# Altium schematic sheet REF-Controller.SchDoc
size 384 x 574 mm; SheetNumber: 1
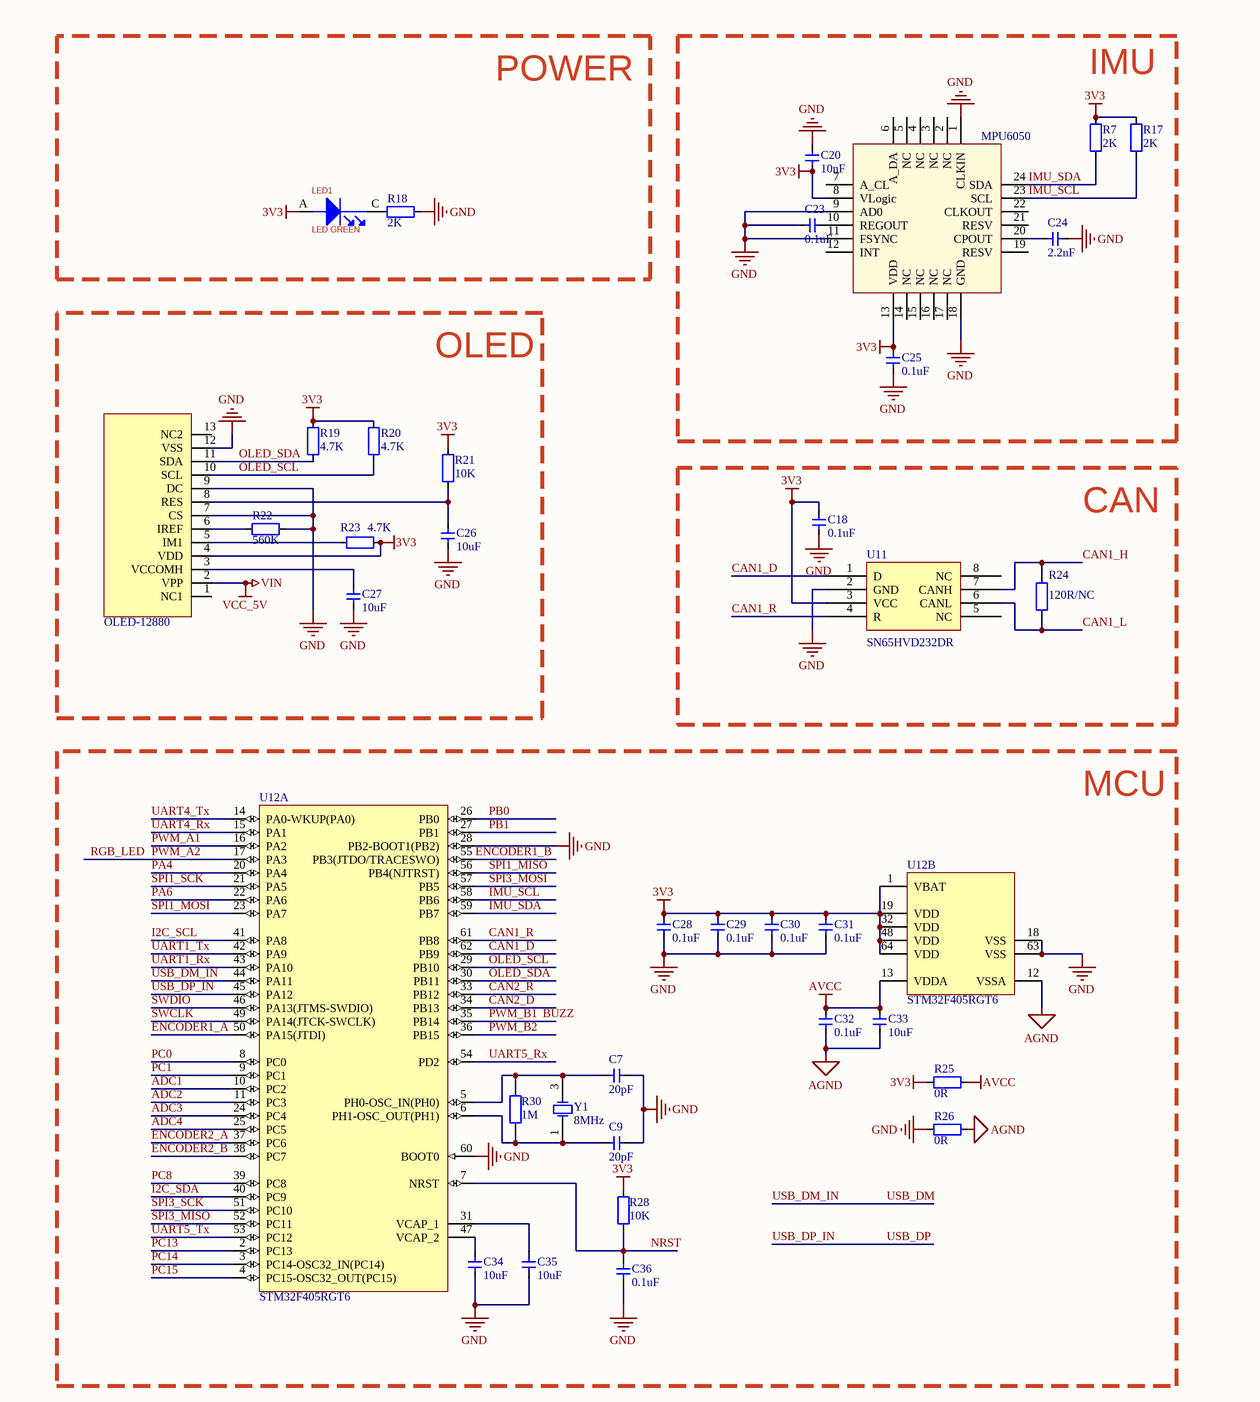
[diagram p0: REF-Controller.SchDoc, top]
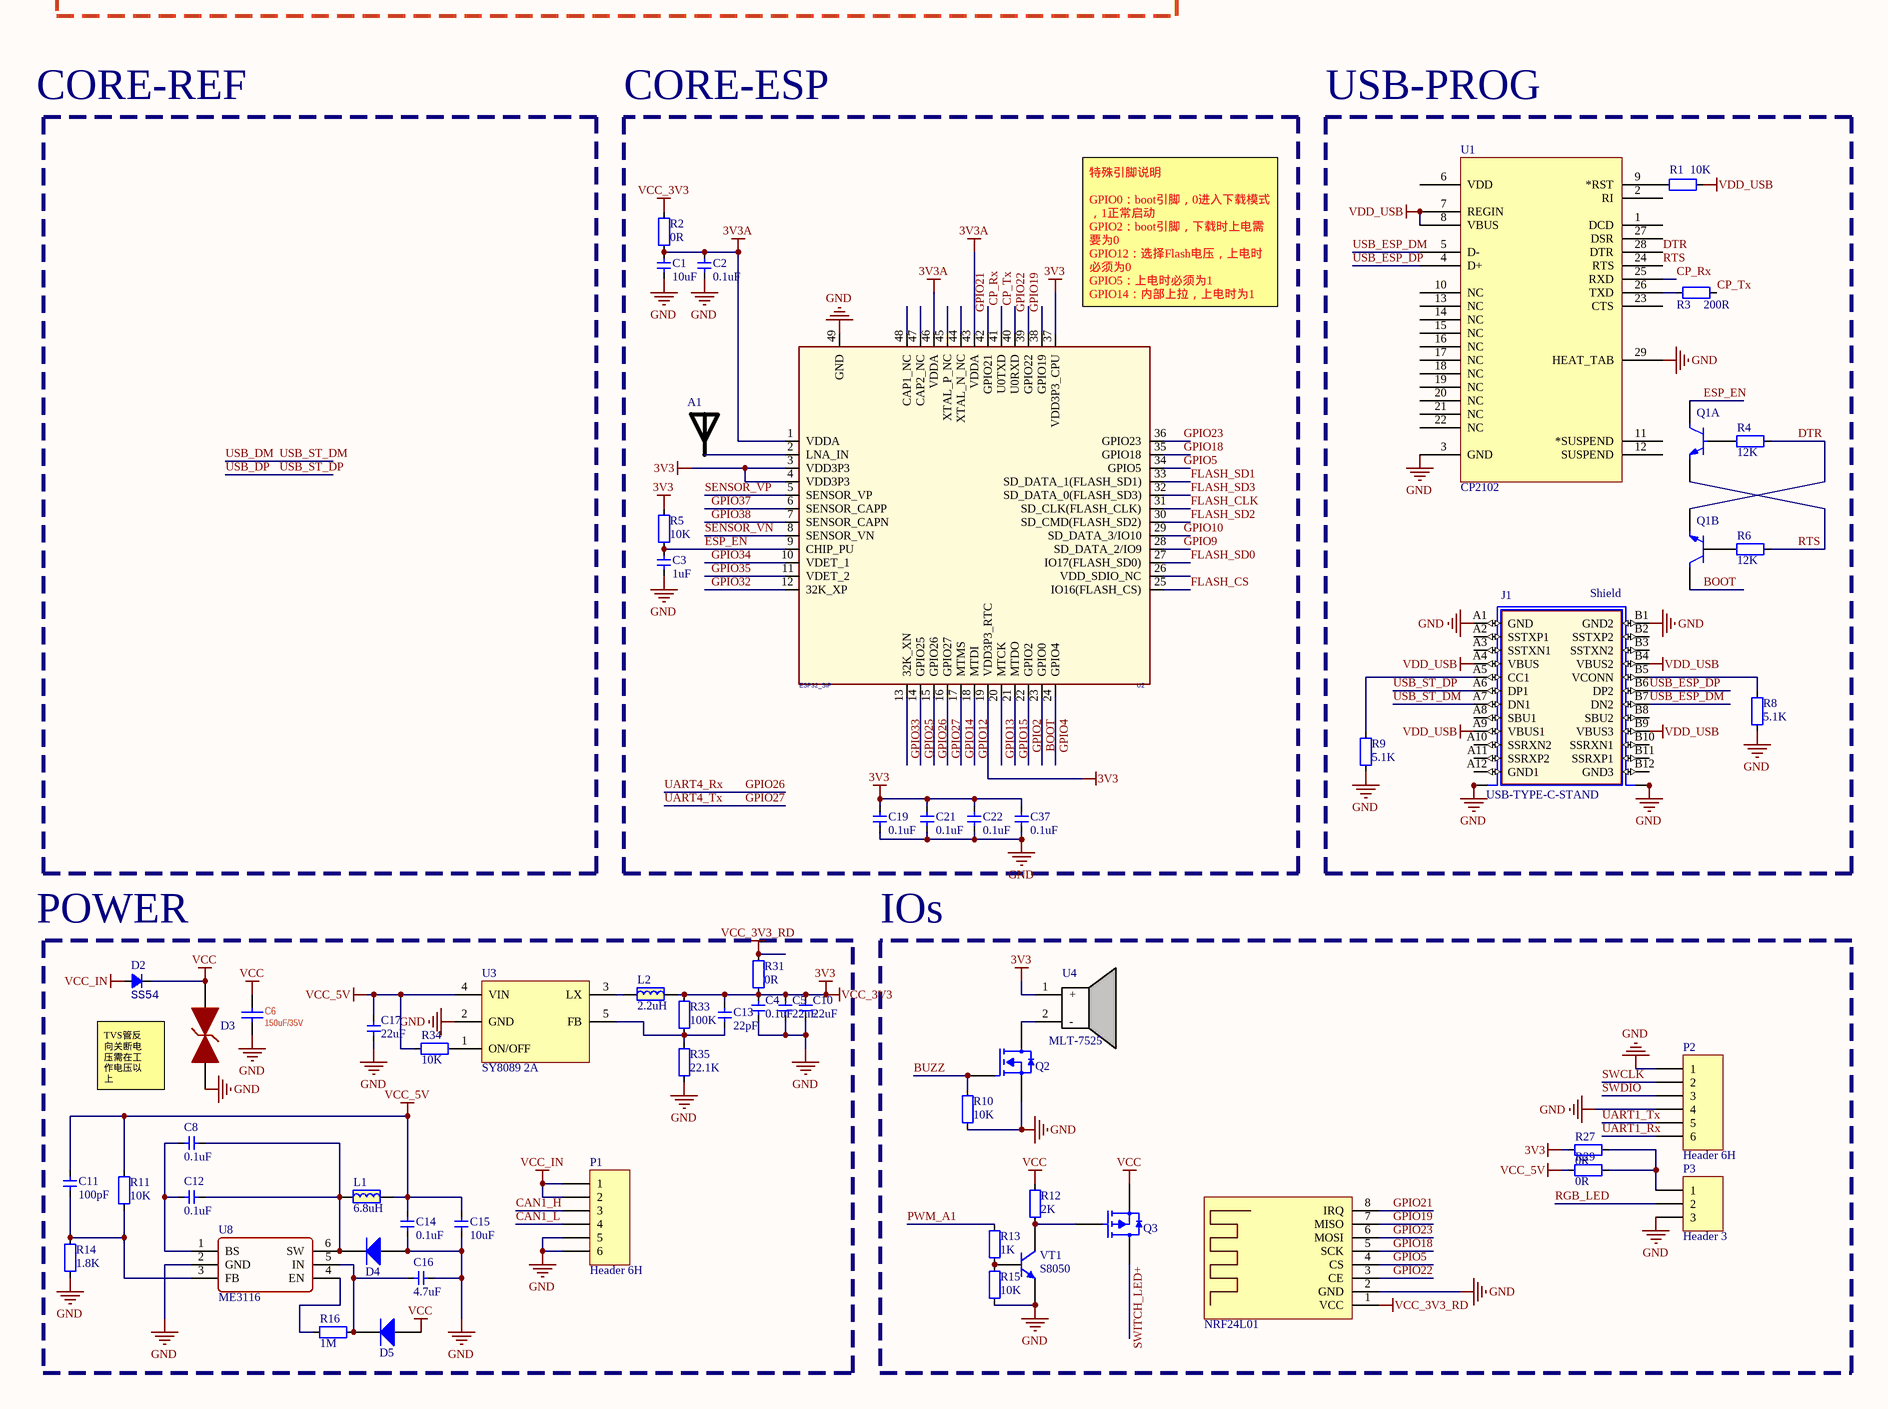
[diagram p1: REF-Controller.SchDoc, bottom]

## Parts
1  OLED-12880  [OLED-12880]
A1  RAINSUN  [ANT-Rainsun-AN5120]  (value not drawn)
C1  10uF  [CAP_0402]
C2  0.1uF  [CAP_0402]
C3  1uF  [CAP_0402]
C4  0.1uF  [CAP_0402]
C5  22uF  [C0603]
C6  value 150uF/35V  [CAP-SMD_BD8.0-L8.3-W8.3-LS9.3-FD]  (hidden comment: 220uF/25V)
C7  20pF  [CAP_0402]
C8  0.1uF  [CAP_0402]
C9  20pF  [CAP_0402]
C10  22uF  [C0603]
C11  100pF  [CAP_0402]
C12  0.1uF  [CAP_0402]
C13  22pF  [CAP_0402]
C14  0.1uF  [CAP_0402]
C15  10uF  [CAP_0402]
C16  4.7uF  [C0603]
C17  22uF  [C0603]
C18  0.1uF  [CAP_0402]
C19  0.1uF  [CAP_0402]
C20  10nF  [CAP_0402]
C21  0.1uF  [CAP_0402]
C22  0.1uF  [CAP_0402]
C23  0.1uF  [CAP_0402]
C24  2.2nF  [CAP_0402]
C25  0.1uF  [CAP_0402]
C26  10uF  [CAP_0402]
C27  10uF  [CAP_0402]
C28  0.1uF  [CAP_0402]
C29  0.1uF  [CAP_0402]
C30  0.1uF  [CAP_0402]
C31  0.1uF  [CAP_0402]
C32  0.1uF  [CAP_0402]
C33  10uF  [CAP_0402]
C34  10uF  [CAP_0402]
C35  10uF  [CAP_0402]
C36  0.1uF  [CAP_0402]
C37  0.1uF  [CAP_0402]
D2  SS54  [DO-214AC]
D3  SMBJ28CA  [SMBJ-CA_MFG]  (value not drawn)
D4  二极管-5819W  [SOD-323]  (value not drawn)
D5  二极管-5819W  [SOD-323]  (value not drawn)
J1  USB-TYPE-C-STAND  [USB-TYPE-C-STAND]
L1  6.8uH  [IND-201612]
L2  2.2uH  [IND-252012A-2R2]
LED1  LED GREEN  [LED-0603]
P1  Header 6H  [CONN-TH_HC-ZH1.5-6A]
P2  Header 6H  [CONN-TH_HC-ZH1.5-6A-s]
P3  Header 3  [CONN-TH_HC-ZH1.5-3A-S]
Q1  BC847BVC-7  [SOT563-6]  (value not drawn)  (parts A,B of 2)
Q2  AO3400A  [SOT23-3]  (value not drawn)
Q3  AO3401A  [SOT23-3]  (value not drawn)
R1  10K  [RES_0402_1]
R2  0R  [RES_0402_1]
R3  200R  [RES_0402_1]
R4  12K  [RES_0402_1]
R5  10K  [RES_0402_1]
R6  12K  [RES_0402_1]
R7  2K  [RES_0402_1]
R8  5.1K  [RES_0402_1]
R9  5.1K  [RES_0402_1]
R10  10K  [RES_0402_1]
R11  10K  [RES_0402_1]
R12  2K  [RES_0402_1]
R13  1K  [RES_0402_1]
R14  1.8K  [RES_0402_1]
R15  10K  [RES_0402_1]
R16  1M  [RES_0402_1]
R17  2K  [RES_0402_1]
R18  2K  [RES_0402_1]
R19  4.7K  [RES_0402_1]
R20  4.7K  [RES_0402_1]
R21  10K  [RES_0402_1]
R22  560K  [RES_0402_1]
R23  4.7K  [RES_0402_1]
R24  120R/NC  [RES_0402_1]
R25  0R  [RES_0402_1]
R26  0R  [RES_0402_1]
R27  0R  [RES_0402_1]
R28  10K  [RES_0402_1]
R29  0R  [RES_0402_1]
R30  1M  [RES_0402]
R31  0R  [RES_0402_1]
R33  100K  [RES_0402_1]
R34  10K  [RES_0402_1]
R35  22.1K  [RES_0402_1]
U1  CP2102  [QFN-28]
U2  ESP32_SIP  [QFN-48_7X7]
U3  SY8089 2A  [SOT23-5]
U4  MLT-7525  [BUZ-SMD_4P-L7.5-W7.5-P7.59-TL]
U7  NRF24L01  [NRF24L01-MODULE]
U8  ME3116  [SOT23-6]
U10  MPU6050  [QFN-24]
U11  Manufacturer Part Number: SN65HVD232DR  [SO-8]  (hidden comment: SN65HVD232D)
U12  STM32F405RGT6  [LQFP-64_N]  (parts A,B of 2)
VT1  S8050  [SMT_TRIODE_NPN]
Y1  value 8MHz  [LC-SMD-3225_4P]  (hidden comment: XTAL-4)

## Blocks framed on the sheet
POWER: LED1 R18
IMU: C20 C23-C25 R7 R17 U10
OLED: 1 C26 C27 R19-R23
CAN: C18 R24 U11
MCU: C7 C9 C28-C36 R25 R26 R28 R30 U12 Y1
CORE-ESP: A1 C1-C3 C19 C21 C22 C37 R2 R5 U2
USB-PROG: J1 Q1 R1 R3 R4 R6 R8 R9 U1
IOs: P2 P3 Q2 Q3 R10 R12 R13 R15 R27 R29 U4 U7 VT1

## Nets
3V3: 1.4(VDD) C4.2 C5.2 C10.2 C13.2 C18.2 C19.2 C20.1 C21.2 C22.2 C25.2 C28.2 C29.2 C30.2 C31.2 C37.2 L2.2 LED1.A(ANODE) R2.1 R5.1 R7.2 R17.2 R19.2 R20.2 R21.2 R23.2 R25.2 R27.2 R28.2 R31.1 R33.2 U2.3(VDD3P3) U2.4(VDD3P3) U2.19(VDD3P3_RTC) U2.37(VDD3P3_CPU) U4.1(+) U10.8(VLogic) U10.13(VDD) U11.3(VCC) U12.1(VBAT) U12.19(VDD) U12.32(VDD) U12.48(VDD) U12.64(VDD)  [also labelled VCC_3V3]
3V3A: C1.2 C2.2 R2.2 U2.1(VDDA) U2.43(VDDA) U2.46(VDDA)
AGND: C32.1 C33.1 R26.1 U12.12(VSSA)
AVCC: C32.2 C33.2 R25.1 U12.13(VDDA)
GND: 1.7(CS) 1.9(DC) 1.12(VSS) C1.1 C2.1 C3.2 C4.1 C5.1 C6.2 C7.2 C9.2 C10.1 C14.1 C15.1 C16.1 C17.1 C18.1 C19.1 C20.2 C21.1 C22.1 C23.2 C24.1 C25.1 C26.1 C27.1 C28.1 C29.1 C30.1 C31.1 C34.1 C35.1 C36.1 C37.1 D3.1 D4.1(A) J1.A1(GND) J1.B1(GND2) J1.S1(SHIELD) J1.S2(SHIELD) J1.S3(SHIELD1) J1.S4(SHIELD1) P1.5 P1.6 P2.1 P2.4 P3.3 Q2.2(S) R8.2 R9.2 R10.1 R14.1 R15.2 R18.1 R22.2 R26.2 R35.1 U1.3(GND) U1.29(HEAT_TAB) U2.49(GND) U3.2(GND) U7.2(GND) U8.2(GND) U10.1(CLKIN) U10.9(AD0) U10.11(FSYNC) U10.18(GND) U11.2(GND) U12.18(VSS) U12.28(PB2-BOOT1(PB2)) U12.60(BOOT0) U12.63(VSS) VT1.2(E)
VCC: C6.1 D2.2(K) D3.2 D5.1(A) Q3.2(S) R12.2
VCC_3V3_RD: R31.2 U7.1(VCC)
VCC_5V: 1.2(VPP) C11.1 C14.2 C15.2 C17.2 L1.2 R11.2 R29.2 R34.2 U3.4(VIN)  [also labelled VIN]
VCC_IN: D2.1(A) P1.1 P1.2
VDD_USB: J1.A4(VBUS) J1.A9(VBUS1) J1.B4(VBUS2) J1.B9(VBUS3) R1.1 U1.7(REGIN) U1.8(VBUS)
ADC1: U12.10(PC2)
ADC2: U12.11(PC3)
ADC3: U12.24(PC4)
ADC4: U12.25(PC5)
BOOT: Q1.3(C2) U2.23(GPIO0)
BUZZ: Q2.1(G) R10.2 U12.35(PB14)  [also labelled PWM_B1]
CAN1_D: U11.1(D) U12.62(PB9)
CAN1_H: P1.3 R24.1 U11.7(CANH)
CAN1_L: P1.4 R24.2 U11.6(CANL)
CAN1_R: U11.4(R) U12.61(PB8)
CAN2_D: U12.34(PB13)
CAN2_R: U12.33(PB12)
CP_Rx: U1.25(RXD) U2.41(U0TXD)
CP_Tx: R3.1 U2.40(U0RXD)
DTR: Q1.4(E2) R4.1 U1.28(DTR)
ENCODER1_A: U12.50(PA15(JTDI))
ENCODER1_B: U12.55(PB3(JTDO/TRACESWO))
ENCODER2_A: U12.37(PC6)
ENCODER2_B: U12.38(PC7)
ESP_EN: C3.1 Q1.6(C1) R5.2 U2.9(CHIP_PU)
FLASH_CLK: U2.31(SD_CLK(FLASH_CLK))
FLASH_CS: U2.25(IO16(FLASH_CS))
FLASH_SD0: U2.27(IO17(FLASH_SD0))
FLASH_SD1: U2.33(SD_DATA_1(FLASH_SD1))
FLASH_SD2: U2.30(SD_CMD(FLASH_SD2))
FLASH_SD3: U2.32(SD_DATA_0(FLASH_SD3))
GPIO2: U2.22(GPIO2)
GPIO4: U2.24(GPIO4)
GPIO5: U2.34(GPIO5) U7.4(CS)
GPIO9: U2.28(SD_DATA_2/IO9)
GPIO10: U2.29(SD_DATA_3/IO10)
GPIO12: U2.18(MTDI)
GPIO13: U2.20(MTCK)
GPIO14: U2.17(MTMS)
GPIO15: U2.21(MTDO)
GPIO18: U2.35(GPIO18) U7.5(SCK)
GPIO19: U2.38(GPIO19) U7.7(MISO)
GPIO21: U2.42(GPIO21) U7.8(IRQ)
GPIO22: U2.39(GPIO22) U7.3(CE)
GPIO23: U2.36(GPIO23) U7.6(MOSI)
GPIO25: U2.14(GPIO25)
GPIO26: U2.15(GPIO26) U12.15(PA1)  [also labelled UART4_Rx]
GPIO27: U2.16(GPIO27) U12.14(PA0-WKUP(PA0))  [also labelled UART4_Tx]
GPIO32: U2.12(32K_XP)
GPIO33: U2.13(32K_XN)
GPIO34: U2.10(VDET_1)
GPIO35: U2.11(VDET_2)
GPIO37: U2.6(SENSOR_CAPP)
GPIO38: U2.7(SENSOR_CAPN)
I2C_SCL: U12.41(PA8)
I2C_SDA: U12.40(PC9)
IMU_SCL: R17.1 U10.23(SCL) U12.58(PB6)
IMU_SDA: R7.1 U10.24(SDA) U12.59(PB7)
NRST: C36.2 R28.1 U12.7(NRST)
OLED_SCL: 1.10(SCL) R20.1 U12.29(PB10)
OLED_SDA: 1.11(SDA) R19.1 U12.30(PB11)
PA4: U12.20(PA4)
PA6: U12.22(PA6)
PB0: U12.26(PB0)
PB1: U12.27(PB1)
PC0: U12.8(PC0)
PC1: U12.9(PC1)
PC8: U12.39(PC8)
PC13: U12.2(PC13)
PC14: U12.3(PC14-OSC32_IN(PC14))
PC15: U12.4(PC15-OSC32_OUT(PC15))
PWM_A1: R13.1 U12.16(PA2)
PWM_A2: P3.2 U12.17(PA3)  [also labelled RGB_LED]
PWM_B2: U12.36(PB15)
RTS: Q1.1(E1) R6.1 U1.24(RTS)
SENSOR_VN: U2.8(SENSOR_VN)
SENSOR_VP: U2.5(SENSOR_VP)
SPI1_MISO: U12.56(PB4(NJTRST))
SPI1_MOSI: U12.23(PA7)
SPI1_SCK: U12.21(PA5)
SPI3_MISO: U12.52(PC11)
SPI3_MOSI: U12.57(PB5)
SPI3_SCK: U12.51(PC10)
SWCLK: P2.2 U12.49(PA14(JTCK-SWCLK))
SWDIO: P2.3 U12.46(PA13(JTMS-SWDIO))
SWITCH_LED+: Q3.3(D)
UART1_Rx: P2.6 U12.43(PA10)
UART1_Tx: P2.5 U12.42(PA9)
UART5_Rx: U12.54(PD2)
UART5_Tx: U12.53(PC12)
USB_DM: J1.A7(DN1) U12.44(PA11)  [also labelled USB_DM_IN, USB_ST_DM]
USB_DP: J1.A6(DP1) U12.45(PA12)  [also labelled USB_DP_IN, USB_ST_DP]
USB_ESP_DM: J1.B7(DN2) U1.5(D-)
USB_ESP_DP: J1.B6(DP2) U1.4(D+)
Net1_3: 1.3(VCCOMH) C27.2
Net1_5: 1.5(IM1) R23.1
Net1_6: 1.6(IREF) R22.1
Net1_8: 1.8(RES) C26.2 R21.1
NetA1_1: A1.1 U2.2(LNA_IN)
NetC7_1: C7.1 R30.1 U12.5(PH0-OSC_IN(PH0)) Y1.3(OSC2)
NetC8_1: C8.1 C12.1 D4.2(K) L1.1 U8.6(SW)
NetC8_2: C8.2 C12.2 U8.1(BS)
NetC9_1: C9.1 R30.2 U12.6(PH1-OSC_OUT(PH1)) Y1.1(OSC1)
NetC11_2: C11.2 R11.1 R14.2 U8.3(FB)
NetC13_1: C13.1 R33.1 R35.2 U3.5(FB)
NetC16_2: C16.2 D5.2(K) R16.1 U8.5(IN)
NetC23_1: C23.1 U10.10(REGOUT)
NetC24_2: C24.2 U10.20(CPOUT)
NetC34_2: C34.2 U12.47(VCAP_2)
NetC35_2: C35.2 U12.31(VCAP_1)
NetJ1_A5: J1.A5(CC1) R9.1
NetJ1_B5: J1.B5(VCONN) R8.1
NetL2_1: L2.1 U3.3(LX)
NetLED1_C: LED1.C(CATHODE) R18.2
NetP3_1: P3.1 R27.1 R29.1
NetQ1_2: Q1.2(B1) R4.2
NetQ1_5: Q1.5(B2) R6.2
NetQ2_3: Q2.3(D) U4.2(-)
NetQ3_1: Q3.1(G) R12.1 VT1.3(C)
NetR1_2: R1.2 U1.9(*RST)
NetR3_2: R3.2 U1.26(TXD)
NetR13_2: R13.2 R15.1 VT1.1(B)
NetR16_2: R16.2 U8.4(EN)
NetR34_1: R34.1 U3.1(ON/OFF)

Not connected (* = marked no-connect by the designer): 1 1(NC1) 13(NC2); J1 A2(SSTXP1) A3(SSTXN1) A8(SBU1) A10(SSRXN2) A11(SSRXP2) A12(GND1) B2(SSTXP2) B3(SSTXN2) B8(SBU2) B10(SSRXN1) B11(SSRXP1) B12(GND3); U1 1(DCD) 2(RI) 6(VDD) 10(NC) 11(*SUSPEND) 12(SUSPEND) 13(NC) 14(NC) 15(NC) 16(NC) 17(NC) 18(NC) 19(NC) 20(NC) 21(NC) 22(NC) 23(CTS) 27(DSR); U2 26(VDD_SDIO_NC) 44(XTAL_N_NC) 45(XTAL_P_NC) 47(CAP2_NC) 48(CAP1_NC); U10 2(NC) 3(NC) 4(NC) 5(NC) 6(A_DA) 7(A_CL) 12(INT) 14(NC) 15(NC) 16(NC) 17(NC) 19(RESV) 21(RESV) 22(CLKOUT); U11 5(NC) 8(NC)

## Notes on the sheet
- CORE-REF
- (near U2) 特殊引脚说明
  GPIO0：boot引脚，0进入下载模式，1正常启动
  GPIO2：boot引脚，下载时上电需要为0
  GPIO12：选择Flash电压，上电时必须为0
  GPIO5：上电时必须为1
  GPIO14：内部上拉，上电时为1
  GPIO15：上电时必须为1
- (near D2) POWER
- TVS管反
  向关断电
  压需在工
  作电压以
  上
- (in symbol USB-TYPE-C-STAND) Shield

## Library data of the parts
A1 = ANT-Rainsun-AP5120
C1-C4 C8 C11 C12 C14 C15 C18-C37 = 电容-0402: Capacitor; Value: 0.1u
C5 C7 C9 C10 C13 C17 = 电容-0402: Capacitor
  C5 C10 C17: Value: 22uF
  C7 C9: Value: 20pF
  C13: Value: 22pF
C6 = CAP: Capacitor, chip, ceramic; Parameters: E22 CAP; PN: RVT1E221M0607; Price: 0.038
C16 = 电容-0402: Capacitor; Value: 4.7uF 35V
D2 = Diode_SMA: Diode; Type: SMA; Value: SS54
D4 D5 = 二极管-5819W: 40V
J1 = USB-TYPE-C-STAND: MP: 632722110112; MF: Wurth Electronics; SnapEDA_Link: https://www.snapeda.com/parts/632722110112/Wurth%20Electronics%20Inc./view-part/3596593/?ref=snap; Price: None; DigiKey-Purchase-URL: https://snapeda.com/shop?store=DigiKey&id=3596593; Package: None; Availability: Unavailable; Value: *
L1 L2 = 电感-201612
LED1 = LED: LED GRN SGL RA 25mA 4.1V SMD; CLASS: IC; CAD_APPROVED: Yes; MFG_PN01: AA4040ZGS; MFG_NAME01: Kingbright; AGILE_PN: 370-76642; PN: 19-217/G7C-AN1P2/3T; HEIGHT: 4.25MM; ROHS: Yes
P1 P2 = Header 6H: Header, 6-Pin, Right Angle; LatestRevisionDate: 17-Jul-2002; LatestRevisionNote: Re-released for DXP Platform.; Publisher: Altium Limited
P3 = Header 3: Header, 3-Pin; LatestRevisionDate: 17-Jul-2002; LatestRevisionNote: Re-released for DXP Platform.; Publisher: Altium Limited
Q2 = AO3400A: N-MOS
Q3 = AO3401A: P-MOS
R1-R26 R28 R30 R34 = 电阻-0402: Resistor; Value: 22R
R27 R29 R31 R33 R35 = 电阻-0402: Resistor
  R27 R29 R31: Value: 0R
  R33: Value: 100K
  R35: Value: 22.1K
U1 = CP2102: USB转TTL; PART DESC: SINGLE-CHIP USB TO UART BRIDGE, QFN28, RoHS.; MFG #1: SILICON LABS; PART NUMBER: CP2102; Value: Value; RefDes: RefDes; Type: DEV
U2 = ESP32-PICO
U3 = SY8089: LDO
U4 = DET402
U7 = NRF24L01模块
U8 = ME3116: DC-DC
U10 = MPU6050: 六轴传感器
U11 = SN65HVD232D: Manufacturer: Texas Instruments; Protocol: CAN; Number of Drivers/Receivers: 1/1; Duplex: Half; Data Rate: 1Mbps; Voltage - Supply: 3 V ~ 3.6 V; Supplier 1: Digi-Key; Supplier Part Number 1: 296-26344-2-ND; RoHS: RoHS Compliant; Category: Integrated Circuits (ICs); Stock: 5000; Pricing 1: 2500=0.84375 (USD); Packaging: Tape & Reel (TR); Part Status: Active; Type: Transceiver; Operating Temperature: -40°C ~ 85°C; Mounting Type: Surface Mount; Package / Case: 8-SOIC (0.154", 3.90mm Width); Supplier Device Package: 8-SOIC; ComponentLink1URL: http://www.ti.com/lit/ds/symlink/sn65hvd230.pdf; ComponentLink1Description: http://www.ti.com/lit/ds/symlink/sn65hvd230.pdf; Supplier 2: Digi-Key; Supplier Part Number 2: 296-26344-1-ND; Pricing 2: 1=2.05, 10=1.842, 100=1.4809, 500=1.21668, 1000=1.00811 (USD)
U12 = STM32F405RGT6: ARM Cortex-M4 32-bit MCU+FPU, 210 DMIPS, 1024 kB Flash, 192 kB Internal RAM, 51 I/Os, 64-pin LQFP, -40 to 85 degC, Tray; Manufacturer: STMicroelectronics; D/A Converter: 2x12-bit; FLASH Size (Prog) (kB): 1024; I/Os (High Current): 51; Internal RAM Size (kB): 192; Operating Frequency(F) (Processor speed) (MHz): 168; Supply Voltage(Vcc) max (V): 3.6; Supply Voltage(Vcc) min (V): 1.8; DatasheetVersion: Rev. 4; PackageVersion: Rev. 4, 06/2013; PackageReference: LQFP64; PackageDescription: 64-Pin Low Profile Quad Flat Package, 10 x 10 mm Body, 0.5 mm Pitch; Supplier 1: Digi-Key; Supplier Part Number 1: 497-11767-ND; Supplier 2: Farnell; Supplier Part Number 2: 2064363; Supplier 3: Newark; Supplier Part Number 3: 73T2329; Supplier 4: Mouser; Supplier Part Number 4: 511-STM32F405RGT6; Core: ARM Cortex-M4; Packing: Tray; Mounting Technology: Surface Mount; PartNumber: STM32F405RGT6; ComponentLink1Description: Manufacturer URL; ComponentLink1URL: http://www.st.com/web/en/home.html; ComponentLink2Description: Datasheet; ComponentLink2URL: http://www.st.com/st-web-ui/static/active/en/resource/technical/document/datasheet/DM00037051.pdf; ComponentLink3Description: Package Specification; ComponentLink3URL: http://www.st.com/st-web-ui/static/active/en/resource/technical/document/datasheet/DM00037051.pdf
VT1 = SMT_TRIODE_NPN: Surface mount NPN transistor, package SOT-23
Y1 = XTAL-4: Crystal; Parameters: 20ppm 20pF -20/+70C; Manufacturer: *; Distributors: Comet; Price: 0.238